# EAGLE design SIM868-ng (EAGLE 9.6.2)
DESCRIPTION: microOBD 200 OBD-II Module; HW_REV: 1.4; PCB_REV: C; PCB_SPEC1: Layer Count: 4; PCB_SPEC2: Size: 1.3" x 0.59"; PCB_SPEC3: Finish Thickness: 0.049" - 0.052"; PCB_SPEC4: Copper Weight: 1oz; TITLE: STM1120
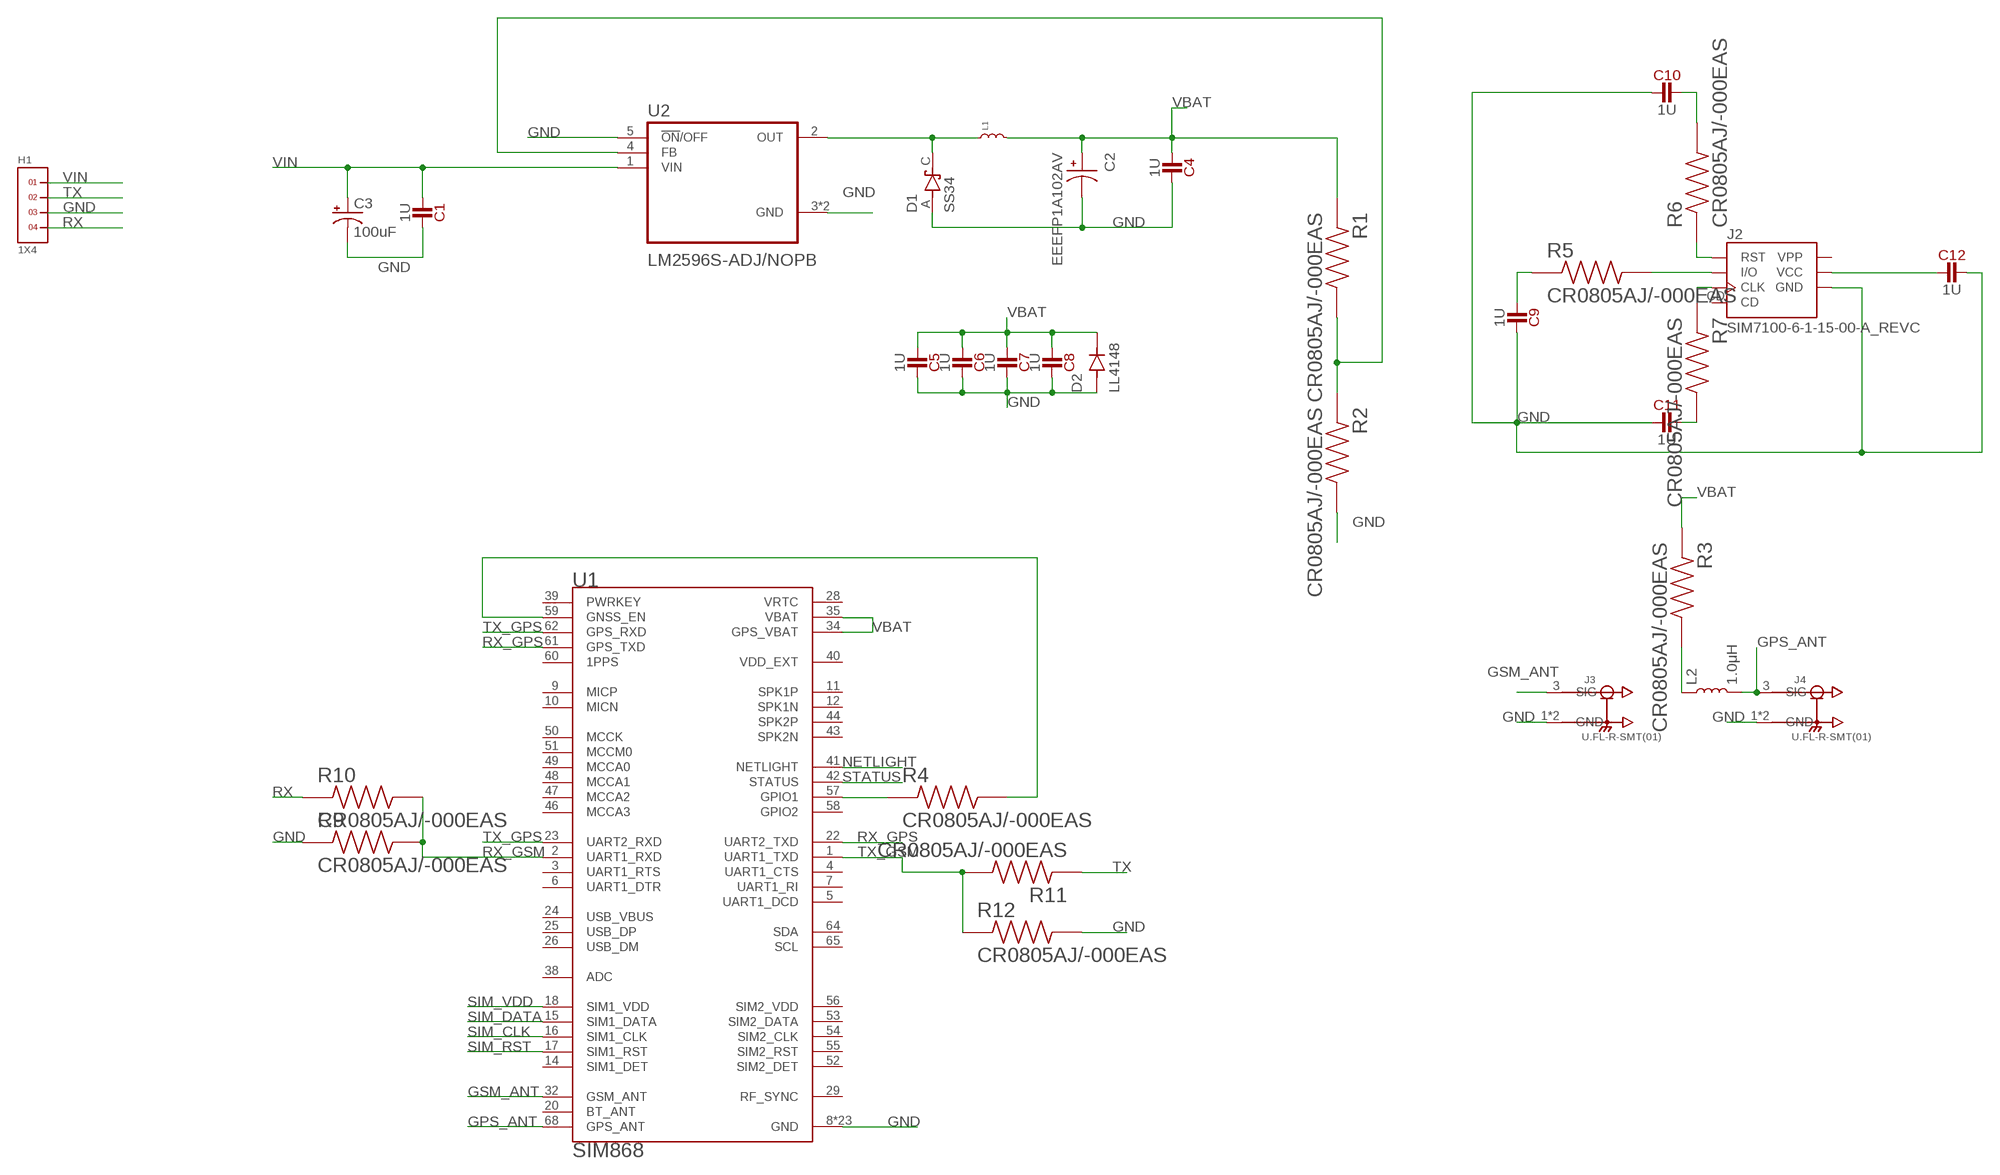
[diagram p0: schematic, sheet 1]

## Parts
C1  1U  [C-0805]
C2  EEEFP1A102AV  [CAP_EEEFP1A102AV]
C3  100uF  100UF-POLAR-EIA3528-10V-20%(TANT)  [EIA3528]
C4  1U  [C-0805]
C5  1U  [C-0805]
C6  1U  [C-0805]
C7  1U  [C-0805]
C8  1U  [C-0805]
C9  1U  [C-0805]
C10  1U  [C-0805]
C11  1U  [C-0805]
C12  1U  [C-0805]
D1  SS34  [DIOM7959X265N]
D2  LL4148  [DIO_LL4148]
H1  1X4  [1X4]
J2  SIM7100-6-1-15-00-A_REVC  [GCT_SIM7100-6-1-15-00-A_REVC]
J3  U.FL-R-SMT(01)  [HRS_U.FL-R-SMT(01)]
J4  U.FL-R-SMT(01)  [HRS_U.FL-R-SMT(01)]
L1  INDUCTOR.XAL1010  [XAL1010]
L2  1.0μH  1.0μH-0805_WIDE-1.0μH-1.45A-0.106OHM-1.0MM_H  [0805-WIDE]
R1  CR0805AJ/-000EAS  [RESC2012X60N]
R2  CR0805AJ/-000EAS  [RESC2012X60N]
R3  CR0805AJ/-000EAS  [RESC2012X60N]
R4  CR0805AJ/-000EAS  [RESC2012X60N]
R5  CR0805AJ/-000EAS  [RESC2012X60N]
R6  CR0805AJ/-000EAS  [RESC2012X60N]
R7  CR0805AJ/-000EAS  [RESC2012X60N]
R9  CR0805AJ/-000EAS  [RESC2012X60N]
R10  CR0805AJ/-000EAS  [RESC2012X60N]
R11  CR0805AJ/-000EAS  [RESC2012X60N]
R12  CR0805AJ/-000EAS  [RESC2012X60N]
U1  SIM868  [XCVR_SIM868]
U2  LM2596S-ADJ/NOPB  [VREG_LM2596S-ADJ/NOPB]

## Nets
GND: C1.2 C2.2 C3.C(-) C4.2 C5.2 C6.2 C7.2 C8.2 C9.2 C10.1 C11.1 C12.2 D1.A D2.A H1.3 J2.C5(GND) J3.1(GND) J3.2(GND) J4.1(GND) J4.2(GND) R2.2 R9.1 R12.2 U1.8(GND) U1.13(GND) U1.19(GND) U1.21(GND) U1.27(GND) U1.30(GND) U1.31(GND) U1.33(GND) U1.36(GND) U1.37(GND) U1.45(GND) U1.63(GND) U1.66(GND) U1.67(GND) U1.69(GND) U1.70(GND) U1.71(GND) U1.72(GND) U1.73(GND) U1.74(GND) U1.75(GND) U1.76(GND) U1.77(GND) U2.3(GND) U2.5(!ON!/OFF) U2.6(GND)
GPS_ANT: J4.3(SIG) L2.2 U1.68(GPS_ANT)
GSM_ANT: J3.3(SIG) U1.32(GSM_ANT)
N$1: D1.C(K) L1.P$1 U2.2(OUT)
N$2: R4.1 U1.57(GPIO1)
N$3: R1.2 R2.1 U2.4(FB)
N$4: L2.1 R3.2
N$5: R4.2 U1.59(GNSS_EN)
N$6: J2.C7(I/O) R5.2
N$7: C9.1 R5.1
N$8: J2.C2(RST) R6.1
N$9: C10.2 R6.2
N$10: C11.2 R7.2
N$11: J2.C3(CLK) R7.1
N$13: C12.1 J2.C1(VCC)
NETLIGHT: U1.41(NETLIGHT)
RX: H1.4 R10.1
RX_GPS: U1.22(UART2_TXD) U1.61(GPS_TXD)
RX_GSM: R9.2 R10.2 U1.2(UART1_RXD)
SIM_CLK: U1.16(SIM1_CLK)
SIM_DATA: U1.15(SIM1_DATA)
SIM_RST: U1.17(SIM1_RST)
SIM_VDD: U1.18(SIM1_VDD)
STATUS: U1.42(STATUS)
TX: H1.2 R11.1
TX_GPS: U1.23(UART2_RXD) U1.62(GPS_RXD)
TX_GSM: R11.2 R12.1 U1.1(UART1_TXD)
VBAT: C2.1 C4.1 C5.1 C6.1 C7.1 C8.1 D2.C L1.P$2 R1.1 R3.1 U1.34(GPS_VBAT) U1.35(VBAT)
VIN: C1.1 C3.A(+) H1.1 U2.1(VIN)
Unconnected: J2.CD U1.3(UART1_RTS) U1.4(UART1_CTS) U1.5(UART1_DCD) U1.6(UART1_DTR) U1.7(UART1_RI) U1.9(MICP) U1.10(MICN) U1.11(SPK1P) U1.12(SPK1N) U1.14(SIM1_DET) U1.20(BT_ANT) U1.24(USB_VBUS) U1.25(USB_DP) U1.26(USB_DM) U1.29(RF_SYNC) U1.38(ADC) U1.39(PWRKEY) U1.40(VDD_EXT) U1.43(SPK2N) U1.44(SPK2P) U1.46(MCCA3) U1.47(MCCA2) U1.48(MCCA1) U1.49(MCCA0) U1.50(MCCK) U1.51(MCCM0) U1.52(SIM2_DET) U1.53(SIM2_DATA) U1.54(SIM2_CLK) U1.55(SIM2_RST) U1.56(SIM2_VDD) U1.58(GPIO2) U1.60(1PPS) U1.64(SDA) U1.65(SCL)

## Power pins joined to a net without a drawn wire
VPP: J2.C6(VPP)
VRTC: U1.28(VRTC)

## Library data of the parts
C1 C4-C12 = capacitors:?; MOUSER: 77-VJ0805V105ZXXTBC
C2 = EEEFP1A102AV:EEEFP1A102AV: Check availability <https://pricing.snapeda.com/parts/EEE-FP1A102AV/Panasonic/view-part?ref=eda>; AVAILABILITY: In Stock; DESCRIPTION: Aluminum Electrolytic Capacitors, FP-V (????????) Series, 1000uF +/- 20%, 10V, Surface mount type(10x10.5mm) Vibration-proof product; MF: Panasonic; MP: EEE-FP1A102AV; PACKAGE: RADIAL-2 Panasonic; PRICE: None; PURCHASE-URL: https://pricing.snapeda.com/search/part/EEE-FP1A102AV/?ref=eda
C3 = SparkFun-Capacitors:100UF-POLAR: 100µF polarized capacitors A capacitor is a passive two-terminal electrical component used to store electrical energy temporarily in an electric field.; PROD_ID: CAP-16823
D1 = SS34:SS34: Diode Schottky 40V 3A 2-Pin SMC T/R Check availability <https://pricing.snapeda.com/parts/SS34/ON%20Semiconductor/view-part?ref=eda>; AVAILABILITY: In Stock; DESCRIPTION: Diode Schottky 40 V 3A Surface Mount SMC (DO-214AB); MF: ON Semiconductor; MP: SS34; PACKAGE: SMC-2 ON Semiconductor; PRICE: None; PURCHASE-URL: https://pricing.snapeda.com/search/part/SS34/?ref=eda
D2 = LL4148:LL4148: Surface Mount Switching Glass Check availability <https://pricing.snapeda.com/parts/LL4148/ON/view-part?ref=eda>; AVAILABILITY: In Stock; DESCRIPTION: Diode Standard 75V 300mA (DC) Surface Mount Mini MELF/DL-35; MF: ON; MP: LL4148; PACKAGE: SOD-80 Fairchild Semiconductor; PRICE: None; PURCHASE-URL: https://pricing.snapeda.com/search/part/LL4148/?ref=eda
H1 = headers(.1in):1X4
J2 = SIM7100-6-1-15-00-A_REVC:SIM7100-6-1-15-00-A_REVC: Micro SIM Card Connector - Push-Push Type, 6 Pin, SMT, 1.50mm Profile Check availability <https://pricing.snapeda.com/parts/SIM7100-6-1-15-00-A/Global%20Connector%20Technology/view-part?ref=eda>; AVAILABILITY: In Stock; DESCRIPTION: 7 (6 + 1) Position Card Connector Micro SIM Surface Mount, Right Angle Gold; MF: Global Connector Technology; MP: SIM7100-6-1-15-00-A; PACKAGE: None; PRICE: None; PURCHASE-URL: https://pricing.snapeda.com/search/part/SIM7100-6-1-15-00-A/?ref=eda
J3 J4 = U.FL-R-SMT_01_:U.FL-R-SMT(01): U.FL Series 6 Ghz 50 Ohm Ultra-small SMT Coaxial Cable Receptacle Check availability <https://pricing.snapeda.com/parts/U.FL-R-SMT%2801%29/Hirose%20Electric%20Co%20Ltd/view-part?ref=eda>; AVAILABILITY: In Stock; DESCRIPTION: U.FL (UMCC) Connector Receptacle, Male Pin 50Ohm Surface Mount Solder; MF: Hirose Electric Co Ltd; MP: U.FL-R-SMT(01); PACKAGE: None; PRICE: None; PURCHASE-URL: https://pricing.snapeda.com/search/part/U.FL-R-SMT(01)/?ref=eda
L1 = coilcraft:INDUCTOR
L2 = SparkFun-Coils:1.0μH: 1.0μH Inductor Resist changes in electrical current. Basically a coil of wire. SparkFun Products: SparkFun Edge <https://www.sparkfun.com/products/15170>; PROD_ID: NDUC-14375
R1-R7 R9-R12 = CR0805AJ_-000EAS:CR0805AJ/-000EAS: Check availability <https://pricing.snapeda.com/parts/CR0805AJ/-000EAS/Bourns/view-part?ref=eda>; AVAILABILITY: In Stock; DESCRIPTION: 0 Ohms Jumper 0.125W, 1/8W Chip Resistor 0805 (2012 Metric) Anti-Sulfur, Automotive AEC-Q200, Moisture Resistant Thick Film; MF: Bourns; MP: CR0805AJ/-000EAS; PACKAGE: 2012 Stackpole; PRICE: None; PURCHASE-URL: https://pricing.snapeda.com/search/part/CR0805AJ/-000EAS/?ref=eda
U1 = SIM868:SIM868: Gsm/Gprs+Gnss Module Check availability <https://pricing.snapeda.com/parts/SIM868/MikroElektronika/view-part?ref=eda>; AVAILABILITY: Not in stock; DESCRIPTION: SIM868 GNSS, GSM RF mikroBUS™ Click™ Platform Evaluation Expansion Board; MF: MikroElektronika; MP: SIM868; PACKAGE: None; PRICE: None
U2 = LM2596S-ADJ_NOPB:LM2596S-ADJ/NOPB: Check availability <https://pricing.snapeda.com/parts/LM2596S-ADJ/NOPB/Texas%20Instruments/view-part?ref=eda>; AVAILABILITY: In Stock; DESCRIPTION: SIMPLE SWITCHER&reg; 4.5V to 40V, 3A Low Component Count Step-Down Regulator; MF: Texas Instruments; MP: LM2596S-ADJ/NOPB; PACKAGE: TO-263-5 Texas Instruments; PRICE: None; PURCHASE-URL: https://pricing.snapeda.com/search/part/LM2596S-ADJ/NOPB/?ref=eda

## Net classes
1 highpower: width 0.305 mm

## Board
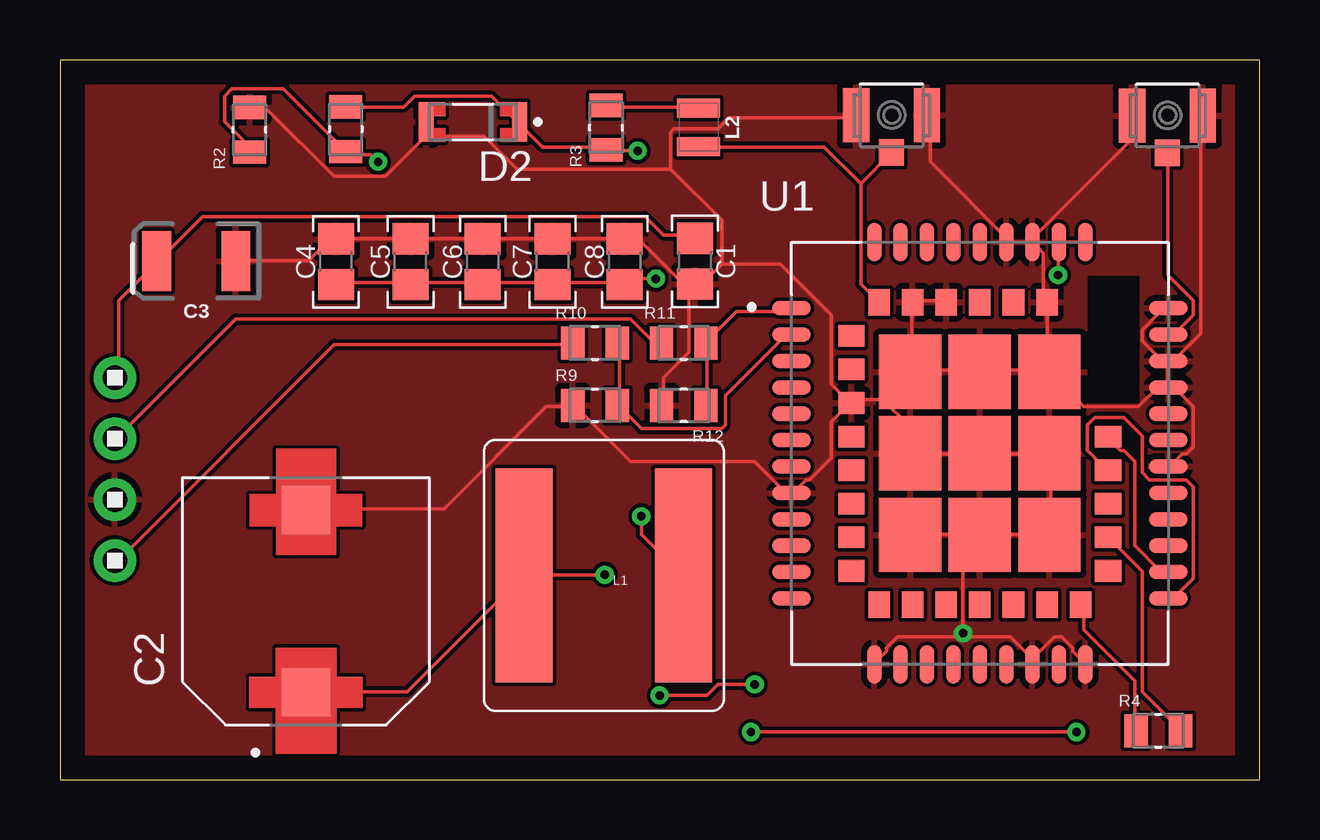
[diagram p1: board, top side]
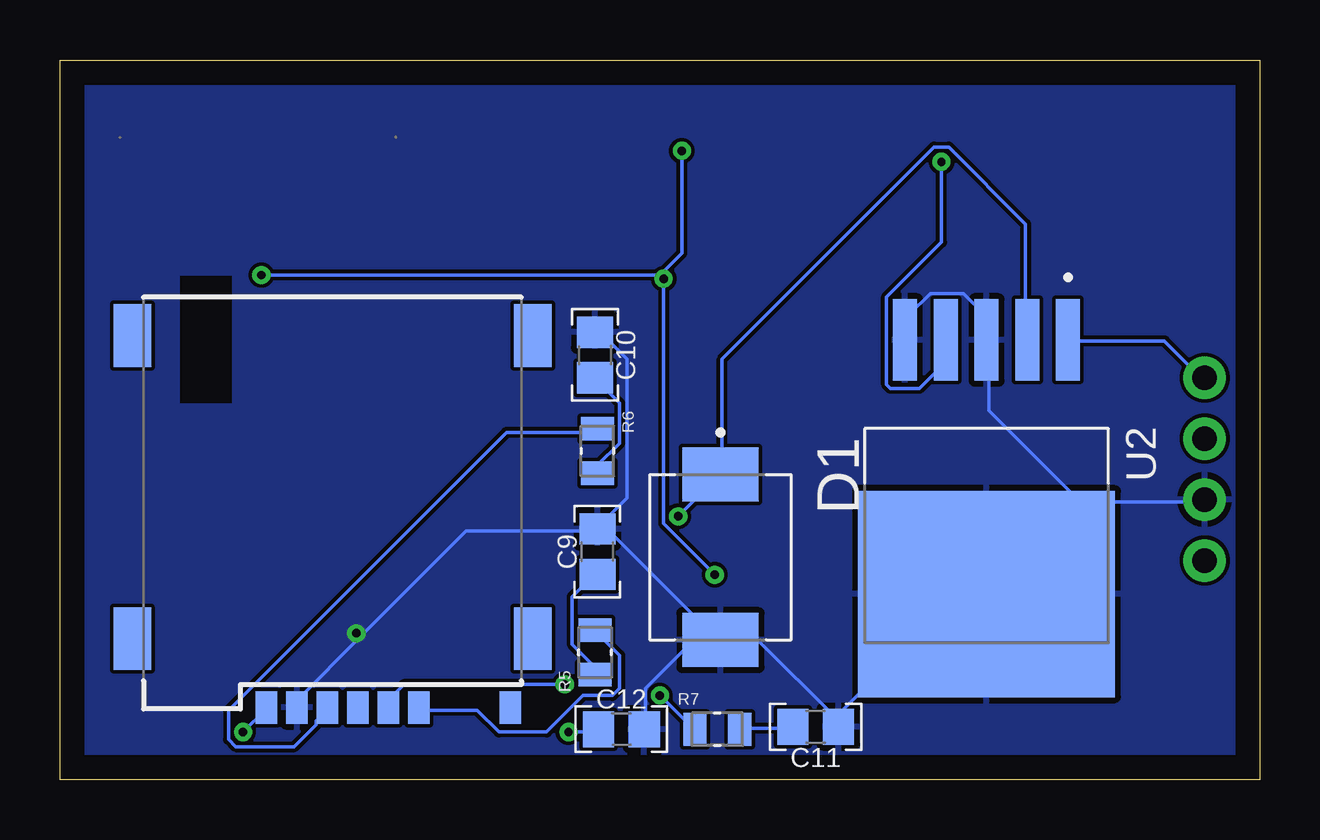
[diagram p2: board, bottom side, seen from below]

Size 50 x 30 mm. Coordinates in mm from the lower left corner, seen from the top.
Outline: 0,0 50,0 50,30 0,30 0,0
Copper layers (1*16): Top 0.035mm / dielectric 1.5mm / Bottom 0.035mm
Design rules "default": minimum track width 6mil, minimum drill 0.35mm, track to track 6mil, track to pad 6mil, pad to pad 6mil, via to via 6mil, smd to smd 6mil, copper to edge 40mil, drill to drill 6mil, minimum pad ring 10mil, minimum via ring 8mil, stop-mask expansion 4mil, vias tented up to drill 0mil, thermal gap 10mil

### Footprints (pad centres in the part's own frame; a part is rotated, then mirrored left to right if it is on the bottom)
C-0805 = smd 1.3 x 1.5: 1 -0.95,0; 2 0.95,0
CAP_EEEFP1A102AV = smd 2 x 2: 1 -3.8,0; 2 3.8,0
EIA3528 = smd 1.2 x 2.5: A 1.65,0; C -1.65,0
DIOM7959X265N = smd 2.25 x 3.18: A 3.455,0; C -3.455,0
DIO_LL4148 = smd 0.6 x 1.65: A 1.95,0; C -1.95,0
1X4 = drill 1.016 pad 1.778: 1 0,0; 2 2.54,0; 3 5.08,0; 4 7.62,0
GCT_SIM7100-6-1-15-00-A_REVC = smd 1.56 x 2.61: 1 -8.34,5.34; 2 -8.34,-7.29; 3 8.34,-7.29; 4 8.34,5.34 | smd 0.9 x 1.35: C1 2.755,8.215; C2 0.215,8.215; C3 -2.325,8.215; C5 1.485,8.215; C6 -1.055,8.215; C7 -3.595,8.215; CD -7.405,8.215
HRS_U.FL-R-SMT(01) = smd 1.1 x 2.25: 1 -1.475,0; 2 1.475,0 | smd 1.05 x 1.1: 3 0,-1.55
XAL1010 = smd 2.38 x 8.91: P$1 -3.325,0; P$2 3.325,0
0805-WIDE = smd 0.8 x 1.8: 1 -0.8,0; 2 0.8,0
RESC2012X60N = smd 0.97 x 1.38: 1 -0.93,0; 2 0.93,0
XCVR_SIM868 = smd 1.6 x 0.6: 1 -7.85,6.05; 2 -7.85,4.95; 3 -7.85,3.85; 4 -7.85,2.75; 5 -7.85,1.65; 6 -7.85,0.55; 7 -7.85,-0.55; 8 -7.85,-1.65; 9 -7.85,-2.75; 10 -7.85,-3.85; 11 -7.85,-4.95; 12 -7.85,-6.05; 22 7.85,-6.05; 23 7.85,-4.95; 24 7.85,-3.85; 25 7.85,-2.75; 26 7.85,-1.65; 27 7.85,-0.55; 28 7.85,0.55; 29 7.85,1.65; 30 7.85,2.75; 31 7.85,3.85; 32 7.85,4.95; 33 7.85,6.05 | smd 0.6 x 1.6: 13 -4.4,-8.8; 14 -3.3,-8.8; 15 -2.2,-8.8; 16 -1.1,-8.8; 17 0,-8.8; 18 1.1,-8.8; 19 2.2,-8.8; 20 3.3,-8.8; 21 4.4,-8.8; 34 4.4,8.8; 35 3.3,8.8; 36 2.2,8.8; 37 1.1,8.8; 38 0,8.8; 39 -1.1,8.8; 40 -2.2,8.8; 41 -3.3,8.8; 42 -4.4,8.8 | smd 1.1 x 0.9: 43 -5.35,4.9; 44 -5.35,3.5; 45 -5.35,2.1; 46 -5.35,0.7; 47 -5.35,-0.7; 48 -5.35,-2.1; 49 -5.35,-3.5; 50 -5.35,-4.9; 58 5.35,-4.9; 59 5.35,-3.5; 60 5.35,-2.1; 61 5.35,-0.7; 62 5.35,0.7 | smd 0.9 x 1.1: 51 -4.2,-6.3; 52 -2.8,-6.3; 53 -1.4,-6.3; 54 0,-6.3; 55 1.4,-6.3; 56 2.8,-6.3; 57 4.2,-6.3; 63 2.8,6.3; 64 1.4,6.3; 65 0,6.3; 66 -1.4,6.3; 67 -2.8,6.3; 68 -4.2,6.3 | smd 2.6 x 3.1: 69 -2.9,3.4; 70 -2.9,0; 71 -2.9,-3.4; 72 0,-3.4; 73 2.9,-3.4; 74 2.9,0; 75 2.9,3.4; 76 0,3.4; 77 0,0
VREG_LM2596S-ADJ/NOPB = smd 3.4 x 1: 1 -10.6,3.4; 2 -10.6,1.7; 3 -10.6,0; 4 -10.6,-1.7; 5 -10.6,-3.4 | smd 8.6 x 10.7: 6 0,0

### Placement (x,y rotation side)
C1  26.47,21.61 270 top
C2  10.25,7.43 90 top
C3  5.68,21.62 180 top
C4  11.5,21.59 90 top
C5  14.61,21.59 90 top
C6  17.62,21.59 90 top
C7  20.53,21.59 90 top
C8  23.54,21.59 90 top
C9  27.6,9.5 90 bottom
C10  27.7,17.7 270 bottom
C11  18.5,2.2 180 bottom
C12  26.6,2.1 0 bottom
D1  22.47,9.27 270 bottom
D2  17.21,27.41 180 top
H1  2.29,16.75 270 top
J2  38.64,11.22 180 bottom
J3  46.16,27.68 0 top
J4  34.66,27.69 0 top
L1  22.67,8.51 180 top
L2  26.62,27.19 270 top
R1  11.91,27.11 270 top
R2  7.9,27.09 90 top
R3  22.76,27.18 90 top
R4  45.78,2.03 0 top
R5  27.7,5.3 90 bottom
R6  27.6,13.7 270 bottom
R7  22.6,2.1 0 bottom
R9  22.3,15.6 0 top
R10  22.3,18.2 0 top
R11  26,18.2 0 top
R12  26,15.6 180 top
U1  38.34,13.6 0 top
U2  11.38,7.73 270 bottom

### Tracks (layer width: path | path; a pad name or v marks a point on that pad's centre or on a via)
GND  (via drill 0.35)
  Top 0.152: C3.C 7.47,21.64 10.36,21.64 11.12,22.4 11.43,22.4 C4.2 11.58,22.55 14.48,22.55 C5.2 14.63,22.55 17.53,22.55 C6.2 17.68,22.55 20.42,22.55 C7.2 20.57,22.55 23.47,22.55 C8.2 23.62,22.4 24.23,22.4 26.21,20.42 | 15.24,26.82 13.56,25.15 11.43,25.15 8.69,27.89 7.92,27.89 R2.2 | 15.24,26.82 15.24,27.28 D2.A 15.24,26.82 | 26.21,20.42 26.21,17.83 25.15,16.76 25.15,15.7 R12.2 | 26.21,20.42 26.36,20.57 C1.2 | 25.45,25.45 25.45,26.98 25.6,27.13 27.43,27.13 27.89,27.58 33.07,27.58 J4.1 | 25.45,25.45 27.58,23.32 27.58,21.49 | 27.58,21.49 26.82,20.73 26.52,20.73 C1.2 | 15.24,26.82 17.68,26.82 19.05,25.45 25.45,25.45 | 26.21,20.42 C1.2 | C2.2 10.36,11.28 16,11.28 20.27,15.54 21.34,15.54 R9.1 21.49,15.54 23.77,13.26 28.96,13.26 30.18,12.04 30.48,12.04 U1.8 30.63,12.04 31.09,12.5 31.24,12.5 32.16,13.41 32.16,14.94 32.92,15.7 | U1.36 40.69,22.25 41,21.95 41,19.96 U1.63 41.15,19.81 41.15,17.07 | 40.39,22.4 U1.36 | 40.39,22.4 39.62,22.4 | 39.62,22.4 39.47,22.4 U1.37 39.62,22.4 | 40.39,22.4 44.65,26.67 44.65,27.58 J3.1 | 40.39,22.4 U1.36 | 39.62,22.4 36.27,25.76 36.27,27.58 J4.2 | U1.27 46.33,13.11 46.79,13.56 46.94,13.56 47.24,13.87 47.24,15.54 46.33,16.46 U1.30 | 46.18,17.22 46.18,16.46 U1.30 | 46.18,17.22 46.18,17.37 U1.31 | 46.18,17.22 45.11,18.29 45.11,18.75 45.87,19.51 46.18,19.51 U1.33 | 46.18,17.22 U1.31 | J3.2 47.55,27.58 47.55,18.59 46.33,17.37 U1.31 | 37.64,5.94 39.62,5.94 40.54,5.03 | 37.64,5.94 34.9,5.94 34.44,5.49 34.44,5.33 33.98,4.88 U1.13 | 40.54,5.03 40.69,4.88 U1.19 40.54,5.03 | 40.54,5.03 41.45,5.94 41.76,5.94 42.22,5.49 42.22,5.33 42.67,4.88 U1.21 | 37.64,10.21 38.25,10.21 U1.72
  Top 0.152: 37.64,10.21 35.51,10.21 U1.71 | U1.72 38.41,10.21 41.15,10.21 U1.73 41.3,10.21 41.3,13.56 U1.74 41.15,13.56 38.41,13.56 U1.77 38.25,13.56 35.51,13.56 U1.70 35.36,13.72 35.36,14.78 34.29,15.85 | 37.64,10.21 v37.64,6.1 37.64,5.94 | 37.64,10.21 U1.72 | U1.66 36.88,19.96 35.66,19.96 U1.67 35.51,19.81 35.51,17.07 | 34.29,15.85 33.07,15.85 U1.45 32.92,15.7 | 34.29,15.85 35.36,16.92 U1.69 | 41.15,17.07 38.41,17.07 U1.76 38.25,17.07 35.51,17.07 | 35.51,17.07 U1.69 | 34.29,15.85 U1.69 | U1.30 46.18,16.31 45.72,16.31 44.96,15.54 42.67,15.54 41.3,16.92 U1.75 41.15,17.07 | 27.58,21.49 30.02,21.49 32.16,19.36 32.16,16.46 32.92,15.7
  Bottom 0.152: U2.5 14.63,18.44 14.63,19.36 13.72,20.27 12.34,20.27 11.43,19.36 11.43,18.44 U2.3 11.28,18.29 11.28,15.39 7.47,11.58 | 7.47,11.58 2.44,11.58 H1.3 | 7.47,11.58 11.28,7.77 U2.6 | 7.47,11.58 U2.6 | 17.68,2.59 17.68,2.29 C11.1 17.68,2.59 | 17.68,2.59 20.88,5.79 22.4,5.79 D1.A | 23.62,5.79 25.6,3.81 25.6,2.13 C12.2 | 23.62,5.79 22.55,5.79 D1.A | 37.49,5.94 33.07,10.36 27.74,10.36 C9.2 | 37.49,5.94 40.08,3.35 40.08,3.05 J2.C5 | 27.43,10.67 27.58,10.52 C9.2 | 27.43,10.67 26.36,11.73 26.36,17.53 26.98,18.14 27.13,18.14 27.58,18.59 C10.1 | 23.62,5.79 23.62,6.86 27.43,10.67 | 23.62,5.79 D1.A | 27.43,10.67 C9.2 | 17.68,2.59 12.65,7.62 11.43,7.62 U2.6 | v37.64,6.1 37.49,5.94
  pour Top: -0.5,30.3 50.2,30.3 51,29.5 51,28.8 51,0 50.3,-0.7 -0.3,-0.7 -0.6,-0.4 -0.6,30.2
  pour Bottom: -0.6,30.8 49.8,30.8 50.6,30 51.1,29.5 51.1,-0.5 49.7,-1.9 49.1,-1.9 0.1,-1.9 -1.4,-0.4 -1.4,30
GPS_ANT
  Top 0.152: 33.38,24.84 31.85,26.36 26.64,26.36 L2.2 | 33.38,24.84 33.38,20.66 U1.68 | J4.3 34.66,26.13 33.38,24.84
GSM_ANT
  Top 0.152: J3.3 46.18,26.06 46.18,21.03 47.24,19.96 47.24,19.36 46.33,18.44 U1.32
N$1  (via drill 0.35)
  Top 0.152: v24.23,10.97 24.23,10.21 25.91,8.53 L1.P$1
  Bottom 0.152: v24.23,10.97 22.55,12.65 D1.C 22.4,12.8 22.4,17.53 13.56,26.36 12.95,26.36 9.75,23.16 9.75,18.44 U2.2
N$2
  Top 0.152: U1.57 42.67,7.16 42.67,6.25 44.81,4.12 44.81,2.13 R4.1
N$3  (via drill 0.35)
  Top 0.152: R2.1 7.77,26.21 7.77,26.52 6.86,27.43 6.86,28.5 7.16,28.8 9.3,28.8 11.89,26.21 R1.2 12.04,26.06 12.95,26.06 v13.26,25.76
  Bottom 0.152: v13.26,25.76 13.26,22.4 15.54,20.12 15.54,16.46 15.39,16.31 14.17,16.31 13.11,17.37 13.11,18.29 U2.4
N$4
  Top 0.152: R3.2 22.86,28.04 26.52,28.04 L2.1
N$5
  Top 0.152: U1.59 43.74,10.06 45.11,8.69 45.11,3.66 46.63,2.13 R4.2
N$6
  Bottom 0.152: J2.C7 34.9,2.9 32.61,2.9 31.7,1.98 29.72,1.98 28.19,3.5 26.98,3.5 26.67,3.81 26.67,5.18 27.58,6.1 R5.2
N$7
  Bottom 0.152: R5.1 27.74,4.42 27.74,4.72 28.65,5.64 28.65,7.62 27.74,8.53 C9.1
N$8
  Bottom 0.152: J2.C2 38.86,2.9 39.32,2.44 39.32,2.29 40.23,1.37 42.67,1.37 42.98,1.68 42.98,2.9 31.39,14.48 27.74,14.48 R6.1
N$9
  Bottom 0.152: R6.2 27.58,12.8 27.58,13.11 26.67,14.02 26.67,15.7 27.58,16.61 C10.2
N$10
  Bottom 0.152: R7.2 21.64,2.13 19.51,2.13 C11.2
N$11  (via drill 0.35)
  Top 0.152: v28.96,3.96 27.43,3.96 26.98,3.5 v24.99,3.5
  Bottom 0.152: v28.96,3.96 35.66,3.96 36.27,3.35 36.27,3.05 J2.C3 | v24.99,3.5 23.62,2.13 R7.1
N$13  (via drill 0.35)
  Top 0.152: v28.8,1.98 v42.37,1.98
  Bottom 0.152: v42.37,1.98 41.45,2.9 J2.C1 | v28.8,1.98 27.58,1.98 C12.1
RX
  Top 0.152: R10.1 21.34,18.14 11.43,18.14 2.44,9.14 H1.4
RX_GPS
  Top 0.152: U1.61 43.59,12.95 42.82,13.72 42.82,14.78 43.13,15.09 44.35,15.09 45.11,14.33 45.11,12.8 45.41,12.5 46.94,12.5 47.24,12.19 47.24,8.38 46.33,7.47 U1.22
RX_GSM
  Top 0.152: R10.2 23.32,18.14 23.32,15.7 R9.2 23.32,15.54 24.23,14.63 27.58,14.63 27.74,14.78 27.74,16 30.18,18.44 30.48,18.44 U1.2
TX
  Top 0.152: R11.1 24.99,18.29 24.69,18.29 23.77,19.2 7.32,19.2 2.44,14.33 H1.2
TX_GPS
  Top 0.152: U1.62 43.74,14.17 44.2,13.72 44.35,13.72 44.81,13.26 44.81,9.75 45.87,8.69 46.18,8.69 U1.23
TX_GSM
  Top 0.152: R12.1 26.98,15.7 26.98,18.14 R11.2 26.98,18.29 28.19,19.51 30.48,19.51 U1.1
VBAT  (via drill 0.35)
  Top 0.152: C2.1 10.36,3.66 14.48,3.66 19.2,8.38 L1.P$2 19.36,8.53 v22.71,8.53 | R1.1 12.04,28.04 14.33,28.04 14.78,28.5 17.98,28.5 19.05,27.43 D2.C 19.2,27.28 20.12,26.36 22.71,26.36 R3.1 22.86,26.21 v24.08,26.21 | C4.1 11.58,20.73 14.48,20.73 C5.1 14.63,20.73 17.53,20.73 C6.1 17.68,20.73 20.42,20.73 C7.1 20.57,20.73 23.47,20.73 C8.1 23.62,20.73 23.77,20.88 v24.84,20.88 | U1.34 42.67,22.4 41.76,22.4 U1.35 41.6,22.25 v41.6,21.03
  Bottom 0.152: 24.99,21.03 v41.6,21.03 | v24.08,26.21 24.08,21.95 24.99,21.03 | 24.99,21.03 v24.84,20.88 24.84,10.67 v22.71,8.53
VIN
  Top 0.152: C1.1 26.36,22.71 25.15,22.71 24.38,23.47 5.94,23.47 4.12,21.64 C3.A 3.96,21.49 2.44,19.96 2.44,16.76 H1.1
  Bottom 0.152: U2.1 7.92,18.29 3.96,18.29 2.44,16.76 H1.1